# Altium schematic sheet usb_conn.SchDoc
size A4; SheetNumber: 4; SheetTotal: 4
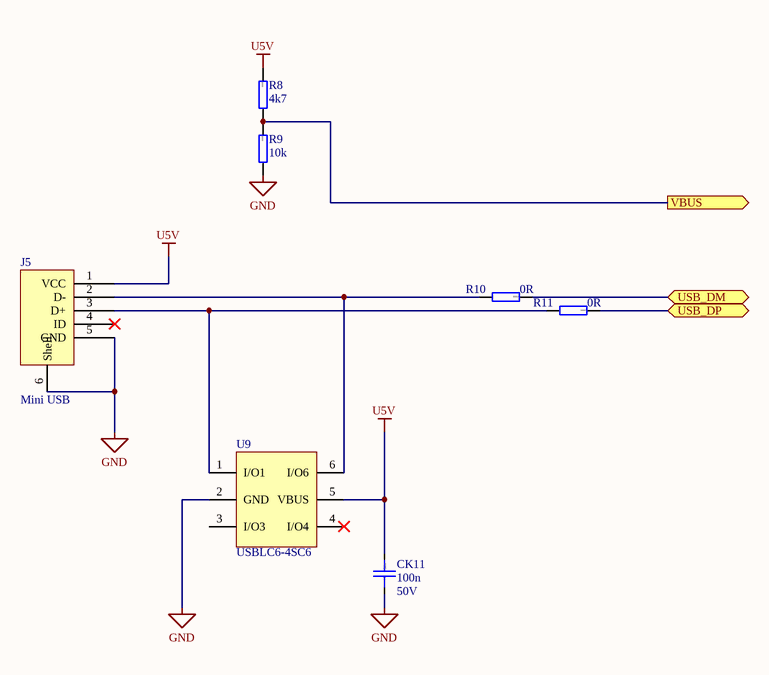
[diagram p0: usb_conn.SchDoc]

## Parts
CK11  100n  Voltage rating: 50V  [CAP0603]
J5  Mini USB  [USB B Mini horizontal]
R8  4k7  [RESC2012X06N(SMR0805)]
R9  10k  [RESC2012X06N(SMR0805)]
R10  0R  [RESC2012X06N(SMR0805)]
R11  0R  [RESC2012X06N(SMR0805)]
U9  USBLC6-4SC6  [SOT23-6]

## Ports
USB_DM (bidir), USB_DP (bidir), VBUS (out)

## Nets
GND: CK11.2 J5.5(GND) J5.6(Shell) R9.1 U9.2(GND)
U5V: CK11.1 J5.1(VCC) R8.2 U9.5(VBUS)
USB_DM: R10.2 ; port USB_DM
USB_DP: R11.2 ; port USB_DP
VBUS: R8.1 R9.2 ; port VBUS
NetJ5_2: J5.2(D-) R10.1 U9.6(I/O6)
NetJ5_3: J5.3(D+) R11.1 U9.1(I/O1)

Not connected (* = marked no-connect by the designer): J5 4(ID)*; U9 3(I/O3) 4(I/O4)*

## Notes on the sheet
- (in symbol Cap 100n 0603) 0603

## Library data of the parts
CK11 = Cap 100n 0603: 50V 100nF X7R ±10% 0603 Multilayer Ceramic Capacitors MLCC - SMD/SMT ROHS; Basic: Yes; Value: 100n; JLCPCB Part: C14663
J5 = Mini USB: Konektor: USB B mini; zásuvka; na PCB; SMT; PIN: 5; vodorovné; TME Part: MX-67503-1020
R8 = Res 4k7 0805: 125mW Thick Film Resistors 150V ±100ppm/℃ ±1% 4.7kΩ 0805 Chip Resistor - Surface Mount ROHS; Tolerance & Rating: 1%/0.1W; Basic: YES; Value: 4k7; Package: 0805; Author: JP/27.03.2014; SMD: 1; ComponentLink3Description: rezistor čip; ComponentLink3URL: heliosgreen://v1/hegMT/5-MT/Classes(343)/Folders/OpenForm?RecordNumbers=[381513]; JLCPCB Part: C17673
R9 = Res 10k 0805: 125mW Thick Film Resistors 150V ±100ppm/℃ ±1% 10kΩ 0805 Chip Resistor - Surface Mount ROHS; Tolerance & Rating: 1%/0.1W; Basic: Yes; Value: 10k; Package: 0805; SMD: 1; ComponentLink3Description: rezistor čip; ComponentLink3URL: heliosgreen://v1/hegMT/5-MT/Classes(343)/Folders/OpenForm?RecordNumbers=[381513]; JLCPCB Part: C17414
R10 R11 = Res 0R 0805: 125mW Thick Film Resistors 150V ±800ppm/℃ ±1% 0Ω 0805 Chip Resistor - Surface Mount ROHS; Tolerance & Rating: 1%/0.1W; Basic: YES; Value: 0R; Package: 0805; Author: JP/27.03.2014; SMD: 1; ComponentLink3Description: rezistor čip; ComponentLink3URL: heliosgreen://v1/hegMT/5-MT/Classes(343)/Folders/OpenForm?RecordNumbers=[381513]; JLCPCB Part: C17477
U9 = USBLC6-4SC6: 5A 17V 6V Unidirectional 5.25V SOT-23-6 ESD and Surge Protection (TVS/ESD) ROHS; Basic: No; JLCPCB Part: C111212